# Altium schematic sheet [02] - nRF52.SchDoc: EE-02 - nRF52
size A4; DocumentNumber: 3; SheetNumber: 3; SheetTotal: 5
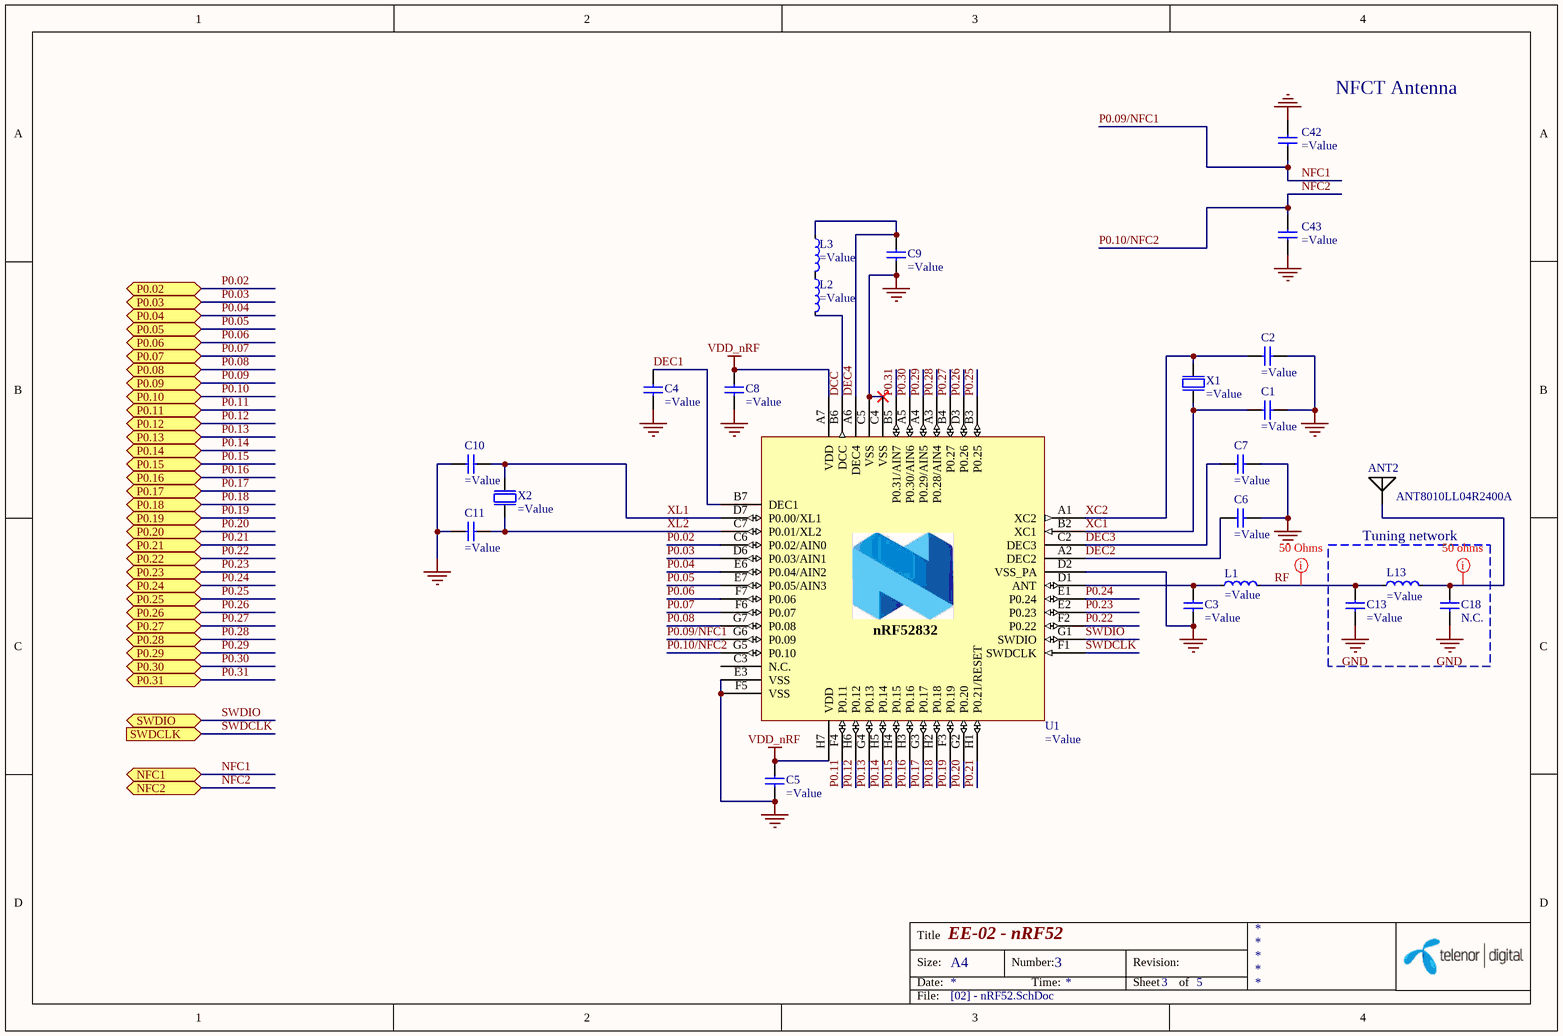
[diagram p0: [02] - nRF52.SchDoc]

## Parts
ANT2  ANT8010LL04R2400A  [YAGEO_24GHz]
C1  (no value)  [CAPC0603X03L]
C2  (no value)  [CAPC0603X03L]
C3  (no value)  [CAPC0603X03L]
C4  (no value)  [CAPC0603X03L]
C5  (no value)  [CAPC0603X03L]
C6  (no value)  [CAPC0603X03L]
C7  (no value)  [CAPC0603X03L]
C8  (no value)  [CAPC1608X06L]
C9  (no value)  [CAPC1005X04L]
C10  (no value)  [CAPC0603X03L]
C11  (no value)  [CAPC0603X03L]
C13  (no value)  [CAPC0603X03L]
C18  N.C.  [CAPC0603X03L]  (no BOM)
C42  (no value)  [CAPC0603X03L]
C43  (no value)  [CAPC0603X03L]
L1  (no value)  [INDC0603X03L]
L2  (no value)  [INDC1608X06L]
L3  (no value)  [INDC1005X04L]
L13  (no value)  [INDC0603X03L]
U1  (no value)  [BGA50C40P7X8_295X322X50]
X1  (no value)  [XTAL_ECS_2016]
X2  (no value)  [XTAL_1610]

## Blocks framed on the sheet
Tuning network: C13 C18 L13

## Ports
NFC1 (bidir), NFC2 (bidir), P0.02 (bidir), P0.03 (bidir), P0.04 (bidir), P0.05 (bidir), P0.06 (bidir), P0.07 (bidir), P0.08 (bidir), P0.09 (bidir), P0.10 (bidir), P0.11 (bidir), P0.12 (bidir), P0.13 (bidir), P0.14 (bidir), P0.15 (bidir), P0.16 (bidir), P0.17 (bidir), P0.18 (bidir), P0.19 (bidir), P0.20 (bidir), P0.21 (bidir), P0.22 (bidir), P0.23 (bidir), P0.24 (bidir), P0.25 (bidir), P0.26 (bidir), P0.27 (bidir), P0.28 (bidir), P0.29 (bidir), P0.30 (bidir), P0.31 (bidir), SWDCLK (in), SWDIO (bidir)

## Nets
GND: C1.2 C2.2 C3.1 C4.2 C5.2 C6.2 C7.2 C8.2 C9.1 C10.2 C11.2 C13.1 C18.1 C42.2 C43.1 U1.C4(VSS) U1.C5(VSS) U1.D2(VSS_PA) U1.E3(VSS) U1.F5(VSS) X1.2 X1.4
VDD_nRF: C5.1 C8.1 U1.A7(VDD) U1.H7(VDD)
DCC: L2.2 U1.B6(DCC)
DEC1: C4.1 U1.B7(DEC1)
DEC2: C6.1 U1.A2(DEC2)
DEC3: C7.1 U1.C2(DEC3)
DEC4: C9.2 L3.1 U1.A6(DEC4)
NFC1: C42.1 U1.G6(P0.09) ; port NFC1  [also labelled P0.09/NFC1]
NFC2: C43.2 U1.G5(P0.10) ; port NFC2  [also labelled P0.10/NFC2]
P0.02: U1.C6(P0.02/AIN0) ; port P0.02
P0.03: U1.D6(P0.03/AIN1) ; port P0.03
P0.04: U1.E6(P0.04/AIN2) ; port P0.04
P0.05: U1.E7(P0.05/AIN3) ; port P0.05
P0.06: U1.F7(P0.06) ; port P0.06
P0.07: U1.F6(P0.07) ; port P0.07
P0.08: U1.G7(P0.08) ; port P0.08
P0.09: port P0.09
P0.10: port P0.10
P0.11: U1.F4(P0.11) ; port P0.11
P0.12: U1.H6(P0.12) ; port P0.12
P0.13: U1.G4(P0.13) ; port P0.13
P0.14: U1.H5(P0.14) ; port P0.14
P0.15: U1.H4(P0.15) ; port P0.15
P0.16: U1.H3(P0.16) ; port P0.16
P0.17: U1.G3(P0.17) ; port P0.17
P0.18: U1.H2(P0.18) ; port P0.18
P0.19: U1.F3(P0.19) ; port P0.19
P0.20: U1.G2(P0.20) ; port P0.20
P0.21: U1.H1(P0.21/RESET) ; port P0.21
P0.22: U1.F2(P0.22) ; port P0.22
P0.23: U1.E2(P0.23) ; port P0.23
P0.24: U1.E1(P0.24) ; port P0.24
P0.25: U1.B3(P0.25) ; port P0.25
P0.26: U1.D3(P0.26) ; port P0.26
P0.27: U1.B4(P0.27) ; port P0.27
P0.28: U1.A3(P0.28/AIN4) ; port P0.28
P0.29: U1.A4(P0.29/AIN5) ; port P0.29
P0.30: U1.A5(P0.30/AIN6) ; port P0.30
P0.31: U1.B5(P0.31/AIN7) ; port P0.31
RF: C13.2 L1.2 L13.1
SWDCLK: U1.F1(SWDCLK) ; port SWDCLK
SWDIO: U1.G1(SWDIO) ; port SWDIO
XC1: C1.1 U1.B2(XC1) X1.1(inp)
XC2: C2.1 U1.A1(XC2) X1.3(out)
XL1: C10.1 U1.D7(P0.00/XL1) X2.1(inp)
XL2: C11.1 U1.C7(P0.01/XL2) X2.2(out)
NetANT2_1: ANT2.1(Feed) C18.2 L13.2
NetC3_2: C3.2 L1.1 U1.D1(ANT)
NetL2_1: L2.1 L3.2

Not connected (* = marked no-connect by the designer): U1 C3(N.C.)

## Layout directives
net class 50 Ohm Impedance: RF
net class 50 ohms impedance: NetANT2_1

## Notes on the sheet
- NFCT Antenna
- Title
- Size:
- Date:
- A4
- Number:
- Time:
- Revision:
- Sheet
- of
- File:
- (in symbol NRF52832-CIAA-R) nRF52832

## Library data of the parts
ANT2 = ANT8010LL04R2400A: CHIP ANTENNA 2.4GHZ; Manufacturer: Yageo; Frequency Group: UHF (2 GHz ~ 3 GHz); Frequency Range: 2.4GHz ~ 2.5GHz; Number of Bands: 1; Gain: 5.46dBi; Power - Max: 1W; Supplier 1: Digi-Key; Manufacturer Part Number: ANT8010LL04R2400A; RoHS: RoHS Compliant; Category: RF/IF and RFID; Stock 1: 771; Pricing 1: 1=1.4, 10=1.241, 25=1.1204, 100=0.9803, 250=0.85972, 500=0.76248, 750=0.66521, 1000=0.60297 (EUR); Packaging: *; Frequency (Center/Band): 2.4GHz; Antenna Type: Chip; VSWR: -; Return Loss: -; Features: -; Termination: Solder; Ingress Protection: -; Mounting Type: Surface Mount; Height (Max): 0.039" (1.00mm); Applications: Bluetooth, WLAN, Zigbee™; ComponentLink1URL: http://www.yageo.com/documents/recent/An_SMD_Bt_11bg_2450_8010_0.pdf; ComponentLink1Description: http://www.yageo.com/documents/recent/An_SMD_Bt_11bg_2450_8010_0.pdf; Supplier Part Number 1: 311-1550-6-ND
C1 C2 C10 C11 = GRM0335C1H120GA01D: CAP CER 12PF 50V NP0 0201; Manufacturer: Murata Electronics North America; Tolerance: ±2%; Temperature Coefficient: C0G, NP0; Manufacturer Part Number: GRM0335C1H120GA01D; Value: 12pF; Supplier 1: Digi-Key; RoHS: RoHS Compliant; Category: Capacitors; Stock 1: 92426; Pricing 1: 1=0.1, 10=0.014, 50=0.0078, 100=0.0066, 250=0.0054, 500=0.00462, 1000=0.0036, 5000=0.003 (USD); Packaging: Digi-Reel®; Capacitance: 12pF; Voltage - Rated: 50V; Mounting Type: Surface Mount, MLCC; Operating Temperature: -55°C ~ 125°C; Applications: General Purpose; Ratings: -; Package / Case: 0201 (0603 Metric); Size / Dimension: 0.024" L x 0.012" W (0.60mm x 0.30mm); Height - Seated (Max): -; Thickness (Max): 0.013" (0.33mm); Lead Spacing: -; Features: -; Lead Style: -; ComponentLink1URL: http://www.murata.com/~/media/webrenewal/support/library/catalog/products/capacitor/mlcc/c02e.pdf; ComponentLink1Description: http://www.murata.com/~/media/webrenewal/support/library/catalog/products/capacitor/mlcc/c02e.pdf; Supplier Part Number 1: 490-11308-6-ND; Part Status: Active; Failure Rate: *
C3 = GRM0335C1H1R0BA01D: CAP CER 1PF 50V NP0 0201; Manufacturer: Murata Electronics North America; Tolerance: ±0.1pF; Temperature Coefficient: C0G, NP0; Manufacturer Part Number: GRM0335C1H1R0BA01D; Value: 1pF; Supplier 1: Digi-Key; RoHS: RoHS Compliant; Category: Capacitors; Stock 1: 205704; Pricing 1: 1=0.1, 10=0.014, 50=0.0078, 100=0.0066, 250=0.0054, 500=0.00462, 1000=0.0036, 5000=0.003 (USD); Packaging: Digi-Reel®; Capacitance: 1pF; Voltage - Rated: 50V; Mounting Type: Surface Mount, MLCC; Operating Temperature: -55°C ~ 125°C; Applications: General Purpose; Ratings: -; Package / Case: 0201 (0603 Metric); Size / Dimension: 0.024" L x 0.012" W (0.60mm x 0.30mm); Height - Seated (Max): -; Thickness (Max): 0.013" (0.33mm); Lead Spacing: -; Features: -; Lead Style: -; ComponentLink1URL: http://www.murata.com/~/media/webrenewal/support/library/catalog/products/capacitor/mlcc/c02e.pdf; ComponentLink1Description: http://www.murata.com/~/media/webrenewal/support/library/catalog/products/capacitor/mlcc/c02e.pdf; Supplier Part Number 1: 490-9660-6-ND; Part Status: Active; Failure Rate: *
C4 C5 = GRM033R61C104KE84D: CAP CER 0.1UF 16V X5R 0201; Manufacturer: Murata Electronics North America; Value: 0.10µF; Tolerance: ±10%; Manufacturer Part Number: GRM033R61C104KE84D; Supplier 1: Digi-Key; RoHS: RoHS Compliant; Category: Capacitors; Stock 1: 0; Pricing 1: 1=0.1, 10=0.025, 50=0.0136, 100=0.0116, 250=0.00944, 500=0.00808, 1000=0.0063, 5000=0.00525 (USD); Packaging: Digi-Reel®; Capacitance: 0.10µF; Voltage - Rated: 16V; Temperature Coefficient: X5R; Mounting Type: Surface Mount, MLCC; Operating Temperature: -55°C ~ 85°C; Applications: General Purpose; Ratings: -; Package / Case: 0201 (0603 Metric); Size / Dimension: 0.024" L x 0.012" W (0.60mm x 0.30mm); Height - Seated (Max): -; Thickness (Max): 0.013" (0.33mm); Lead Spacing: -; Features: Derating Recommended; Lead Style: -; ComponentLink1URL: http://www.murata.com/~/media/webrenewal/support/library/catalog/products/capacitor/mlcc/c02e.pdf; ComponentLink1Description: http://www.murata.com/~/media/webrenewal/support/library/catalog/products/capacitor/mlcc/c02e.pdf; Supplier Part Number 1: 490-9985-6-ND; Part Status: Active; Failure Rate: *
C6 C7 = GRM0335C1H101GA01D: CAP CER 100PF 50V NP0 0201; Manufacturer: Murata Electronics North America; Tolerance: ±2%; Temperature Coefficient: C0G, NP0; Manufacturer Part Number: GRM0335C1H101GA01D; Value: 100pF; Supplier 1: Digi-Key; RoHS: RoHS Compliant; Category: Capacitors; Stock 1: 457199; Pricing 1: 1=0.1, 10=0.014, 50=0.0078, 100=0.0066, 250=0.0054, 500=0.00462, 1000=0.0036, 5000=0.003 (USD); Packaging: Digi-Reel®; Capacitance: 100pF; Voltage - Rated: 50V; Mounting Type: Surface Mount, MLCC; Operating Temperature: -55°C ~ 125°C; Applications: General Purpose; Ratings: -; Package / Case: 0201 (0603 Metric); Size / Dimension: 0.024" L x 0.012" W (0.60mm x 0.30mm); Height - Seated (Max): -; Thickness (Max): 0.013" (0.33mm); Lead Spacing: -; Features: -; Lead Style: -; ComponentLink1URL: http://www.murata.com/~/media/webrenewal/support/library/catalog/products/capacitor/mlcc/c02e.pdf; ComponentLink1Description: http://www.murata.com/~/media/webrenewal/support/library/catalog/products/capacitor/mlcc/c02e.pdf; Supplier Part Number 1: 490-7751-6-ND; Part Status: Active; Failure Rate: *
C8 = GRM188R60J475KE19D: CAP CER 4.7UF 6.3V X5R 0603; Manufacturer: Murata Electronics North America; Value: 4.7µF; Tolerance: ±10%; Manufacturer Part Number: GRM188R60J475KE19D; Supplier 1: Digi-Key; RoHS: RoHS Compliant; Category: Capacitors; Stock 1: 652092; Pricing 1: 1=0.12, 10=0.08, 50=0.046, 100=0.038, 250=0.032, 500=0.0268, 1000=0.022 (USD); Packaging: Digi-Reel®; Capacitance: 4.7µF; Voltage - Rated: 6.3V; Temperature Coefficient: X5R; Mounting Type: Surface Mount, MLCC; Operating Temperature: -55°C ~ 85°C; Applications: General Purpose; Ratings: -; Package / Case: 0603 (1608 Metric); Size / Dimension: 0.063" L x 0.031" W (1.60mm x 0.80mm); Height - Seated (Max): -; Thickness (Max): 0.035" (0.90mm); Lead Spacing: -; Features: -; Lead Style: -; ComponentLink1URL: http://www.murata.com/~/media/webrenewal/support/library/catalog/products/capacitor/mlcc/c02e.pdf; ComponentLink1Description: http://www.murata.com/~/media/webrenewal/support/library/catalog/products/capacitor/mlcc/c02e.pdf; Supplier Part Number 1: 490-3297-6-ND
C9 = GRM155R70J105KA12D: CAP CER 1UF 6.3V X7R 0402; Manufacturer: Murata Electronics North America; Value: 1µF; Tolerance: ±10%; Manufacturer Part Number: GRM155R70J105KA12D; Supplier 1: Digi-Key; RoHS: RoHS Compliant; Category: Capacitors; Stock 1: 3321; Pricing 1: 1=0.1, 10=0.072, 50=0.039, 100=0.033, 250=0.027, 500=0.0231, 1000=0.018, 5000=0.015 (USD); Packaging: Digi-Reel®; Capacitance: 1µF; Voltage - Rated: 6.3V; Temperature Coefficient: X7R; Mounting Type: Surface Mount, MLCC; Operating Temperature: -55°C ~ 125°C; Applications: General Purpose; Ratings: -; Package / Case: 0402 (1005 Metric); Size / Dimension: 0.039" L x 0.020" W (1.00mm x 0.50mm); Height - Seated (Max): -; Thickness (Max): 0.022" (0.55mm); Lead Spacing: -; Features: Derating Recommended; Lead Style: -; ComponentLink1URL: http://www.murata.com/~/media/webrenewal/support/library/catalog/products/capacitor/mlcc/c02e.pdf; ComponentLink1Description: http://www.murata.com/~/media/webrenewal/support/library/catalog/products/capacitor/mlcc/c02e.pdf; Supplier Part Number 1: 490-10024-6-ND; Part Status: Active; Failure Rate: *
C13 = 250R05L3R0BV4T: CAP CER 3PF 25V NP0 0201; Manufacturer: Johanson Technology Inc.; Tolerance: ±0.1pF; Temperature Coefficient: C0G, NP0; Manufacturer Part Number: 250R05L3R0BV4T; Value: 3pF; Supplier 1: Digi-Key; RoHS: RoHS Compliant; Category: Capacitors; Stock 1: 107635; Pricing 1: 1=0.23, 10=0.16, 25=0.1172, 50=0.0958, 100=0.0809, 250=0.06596, 500=0.05532, 1000=0.04894, 5000=0.04256 (USD); Packaging: Digi-Reel®; Part Status: Active; Capacitance: 3pF; Voltage - Rated: 25V; Operating Temperature: -55°C ~ 125°C; Features: High Q, Low Loss; Ratings: -; Applications: RF, Microwave, High Frequency; Mounting Type: Surface Mount, MLCC; Package / Case: 0201 (0603 Metric); Size / Dimension: 0.024" L x 0.012" W (0.60mm x 0.30mm); Height - Seated (Max): -; Thickness (Max): 0.013" (0.33mm); Lead Spacing: -; Lead Style: -; ComponentLink1URL: http://www.johansontechnology.com/downloads/JTI-CAT-MLCC-HighQ.pdf; ComponentLink1Description: http://www.johansontechnology.com/downloads/JTI-CAT-MLCC-HighQ.pdf; Supplier Part Number 1: 712-1191-6-ND
C18 = CAP_0201-NC: Capacitor, 0201, N.C.; Part Number: C0201-NC; Artikkelnr Noca: N.A.; Manufacturer: *; Manufacturer Part Number: *; Datasheet: *; LatestRevisionDate: 2016-11-04; Pin Count: 2; Publisher: Telenor Digital; Published: 2016-11-04; Value: N.C.; Note: *; Supplier: *; Supplier part number: *; 2nd source Supplier: *; 2nd source part number: *; Footprint Doc: 0201; Artikkelnr Simpro: N.A.
C42 C43 = GRM033R71C331KA01D: CAP CER 330PF 16V X7R 0201; Manufacturer: Murata Electronics North America; Tolerance: ±10%; Manufacturer Part Number: GRM033R71C331KA01D; Value: 330pF; Supplier 1: Digi-Key; RoHS: RoHS Compliant; Category: Capacitors; Stock 1: 85950; Pricing 1: 1=0.1, 10=0.018, 50=0.0098, 100=0.0083, 250=0.00676, 500=0.00578, 1000=0.0045, 5000=0.00375 (USD); Capacitance: 330pF; Packaging: Digi-Reel®; ComponentLink1URL: http://www.murata.com/~/media/webrenewal/support/library/catalog/products/capacitor/mlcc/c02e.pdf; ComponentLink1Description: http://www.murata.com/~/media/webrenewal/support/library/catalog/products/capacitor/mlcc/c02e.pdf; Supplier Part Number 1: 490-11359-6-ND; Voltage - Rated: 16V; Temperature Coefficient: X7R; Mounting Type: Surface Mount, MLCC; Operating Temperature: -55°C ~ 125°C; Applications: General Purpose; Ratings: -; Package / Case: 0201 (0603 Metric); Size / Dimension: 0.024" L x 0.012" W (0.60mm x 0.30mm); Height - Seated (Max): -; Thickness (Max): 0.013" (0.33mm); Lead Spacing: -; Features: -; Lead Style: -; Part Status: Active; Failure Rate: *
L1 = LQP03TN3N3B02D: FIXED IND 3.3NH 450MA 250 MOHM; Manufacturer: Murata Electronics North America; Type: Thin Film; Material - Core: Non-Magnetic; Tolerance: ±0.1nH; Shielding: Unshielded; DC Resistance (DCR): 250 mOhm Max; Q @ Freq: 14 @ 500MHz; Frequency - Self Resonant: 8GHz; Frequency - Test: 500MHz; Manufacturer Part Number: LQP03TN3N3B02D; Value: 3.3nH; Supplier 1: Digi-Key; RoHS: RoHS Compliant; Category: Inductors, Coils, Chokes; Stock 1: 28077; Pricing 1: 1=0.1, 10=0.05, 25=0.0452, 50=0.0406, 100=0.0351, 250=0.03152, 500=0.02926, 750=0.027, 1000=0.02565 (USD); Packaging: Digi-Reel®; Inductance: 3.3nH; Current Rating: 450mA; Current - Saturation: -; Ratings: -; Operating Temperature: -55°C ~ 125°C; Mounting Type: Surface Mount; Package / Case: 0201 (0603 Metric); Size / Dimension: 0.024" L x 0.012" W (0.60mm x 0.30mm); Height - Seated (Max): 0.013" (0.33mm); ComponentLink1URL: http://search.murata.co.jp/Ceramy/image/img/P02/JELF243C-0015.pdf; ComponentLink1Description: http://search.murata.co.jp/Ceramy/image/img/P02/JELF243C-0015.pdf; Supplier Part Number 1: 490-12988-6-ND; Part Status: Active
L2 = LBMF1608T100K: FIXED IND 10UH 80MA 360 MOHM SMD; Manufacturer: Taiyo Yuden; Value: 10µH; Type: Wirewound; Tolerance: ±10%; Shielding: Unshielded; Frequency - Self Resonant: 32MHz; Frequency - Test: 2.52MHz; Manufacturer Part Number: LBMF1608T100K; Supplier 1: Digi-Key; RoHS: RoHS Compliant; Category: Inductors, Coils, Chokes; Stock 1: 39014; Pricing 1: 1=0.25, 10=0.225, 25=0.2024, 50=0.1756, 100=0.1575, 250=0.14624, 500=0.135, 1000=0.117 (USD); Packaging: Digi-Reel®; Material - Core: -; Inductance: 10µH; Current Rating: 80mA; Current - Saturation: -; DC Resistance (DCR): 360 mOhm; Q @ Freq: -; Ratings: -; Operating Temperature: -40°C ~ 105°C; Mounting Type: Surface Mount; Package / Case: 0603 (1608 Metric); Size / Dimension: 0.063" L x 0.031" W (1.60mm x 0.80mm); Height - Seated (Max): 0.039" (1.00mm); ComponentLink1URL: http://ds.yuden.co.jp/TYCOMPAS/ut/detail.do?productNo=LBMF1608T100K&fileName=LBMF1608T100K_SS&mode=specSheetDownload; ComponentLink1Description: http://ds.yuden.co.jp/TYCOMPAS/ut/detail.do?productNo=LBMF1608T100K&fileName=LBMF1608T100K_SS&mode=specSheetDownload; Supplier Part Number 1: 587-1714-6-ND
L3 = HK100515NJ-T: FIXED IND 15NH 320MA 460 MOHM; Manufacturer: Taiyo Yuden; Type: Multilayer; Material - Core: Ferrite; Tolerance: ±5%; Shielding: Unshielded; DC Resistance (DCR): 460 mOhm Max; Q @ Freq: 8 @ 100MHz; Frequency - Self Resonant: 2.3GHz; Frequency - Test: 100MHz; Manufacturer Part Number: HK100515NJ-T; Value: 15nH; Supplier 1: Digi-Key; RoHS: RoHS Compliant; Category: Inductors, Coils, Chokes; Stock 1: 163730; Pricing 1: 1=0.1, 10=0.06, 25=0.054, 50=0.0468, 100=0.042, 250=0.039, 500=0.036, 1000=0.0312 (USD); Packaging: Digi-Reel®; Inductance: 15nH; Current Rating: 320mA; Current - Saturation: -; Ratings: -; Operating Temperature: -55°C ~ 125°C; Mounting Type: Surface Mount; Package / Case: 0402 (1005 Metric); Size / Dimension: 0.039" L x 0.020" W (1.00mm x 0.50mm); Height - Seated (Max): 0.022" (0.55mm); ComponentLink1URL: http://ds.yuden.co.jp/TYCOMPAS/ut/detail.do?productNo=HK100515NJ-T&fileName=HK100515NJ-T_SS&mode=specSheetDownload; ComponentLink1Description: http://ds.yuden.co.jp/TYCOMPAS/ut/detail.do?productNo=HK100515NJ-T&fileName=HK100515NJ-T_SS&mode=specSheetDownload; Supplier Part Number 1: 587-1521-6-ND
L13 = LQP03TN3N3B02D: FIXED IND 3.3NH 450MA 250 MOHM; Manufacturer: Murata Electronics North America; Tolerance: ±0.1nH; Type: Thin Film; Material - Core: Non-Magnetic; Shielding: Unshielded; DC Resistance (DCR): 250 mOhm Max; Q @ Freq: 14 @ 500MHz; Frequency - Self Resonant: 8GHz; Frequency - Test: 500MHz; Supplier 1: Digi-Key; Manufacturer Part Number: LQP03TN3N3B02D; RoHS: RoHS Compliant; Category: Inductors, Coils, Chokes; Stock 1: 28077; Pricing 1: 1=0.1, 10=0.05, 25=0.0452, 50=0.0406, 100=0.0351, 250=0.03152, 500=0.02926, 750=0.027, 1000=0.02565 (USD); Packaging: Digi-Reel®; Operating Temperature: -55°C ~ 125°C; Package / Case: 0201 (0603 Metric); Size / Dimension: 0.024" L x 0.012" W (0.60mm x 0.30mm); ComponentLink1URL: http://search.murata.co.jp/Ceramy/image/img/P02/JELF243C-0015.pdf; ComponentLink1Description: http://search.murata.co.jp/Ceramy/image/img/P02/JELF243C-0015.pdf; Supplier Part Number 1: 490-12988-6-ND; Value: 3.3nH; Part Status: Active; Height - Seated (Max): 0.013" (0.33mm); Inductance: 3.3nH; Current Rating: 450mA; Current - Saturation: -; Ratings: -; Mounting Type: Surface Mount
U1 = NRF52832-CIAA-R: nRF52832-CIAA - IC RF TXRX+MCU BLUETOOTH 50WLCSP; Manufacturer: Nordic Semiconductor ASA; Manufacturer Part Number: NRF52832-CIAA-R; Supplier 1: Digi-Key; RoHS: RoHS Compliant; Category: RF/IF and RFID; Stock 1: 0; Pricing 1: 1=5.91, 10=5.276, 25=4.7488, 100=4.3265, 250=3.90444, 500=3.50344, 1000=2.9547 (USD); Packaging: Digi-Reel®; Part Status: Active; Type: TxRx + MCU; RF Family/Standard: *; Protocol: *; Modulation: *; Frequency: *; Data Rate (Max): *; Power - Output: *; Sensitivity: *; Memory Size: *; Serial Interfaces: *; GPIO: *; Voltage - Supply: *; Current - Receiving: *; Current - Transmitting: *; Operating Temperature: *; Package / Case: *; ComponentLink1URL: http://infocenter.nordicsemi.com/pdf/nRF52832_PB_v1.4.pdf; ComponentLink1Description: http://infocenter.nordicsemi.com/pdf/nRF52832_PB_v1.4.pdf; Supplier Part Number 1: 1490-1056-6-ND; Value: NRF52832-CIAA-R
X1 = ECS-320-8-37CKM: CRYSTAL 32.0000MHZ 8PF SMD; Manufacturer: ECS Inc.; Value: 32MHz; Frequency Stability: ±10ppm; ESR (Equivalent Series Resistance): 60 Ohm; Operating Mode: Fundamental; Manufacturer Part Number: ECS-320-8-37CKM; Supplier 1: Digi-Key; RoHS: RoHS Compliant; Category: Crystals, Oscillators, Resonators; Stock 1: 8917; Pricing 1: 1=1.09, 10=0.968, 50=0.904, 100=0.8, 500=0.756 (USD); Packaging: Digi-Reel®; Type: MHz Crystal; Frequency: 32MHz; Frequency Tolerance: ±10ppm; Load Capacitance: 8pF; Operating Temperature: -20°C ~ 70°C; Ratings: -; Mounting Type: Surface Mount; Package / Case: 4-SMD, No Lead (DFN, LCC); Size / Dimension: 0.079" L x 0.063" W (2.00mm x 1.60mm); Height: 0.020" (0.50mm); ComponentLink1URL: http://www.ecsxtal.com/store/pdf/ecx-1637.pdf; ComponentLink1Description: http://www.ecsxtal.com/store/pdf/ecx-1637.pdf; Supplier Part Number 1: XC1547DKR-ND; Part Status: Active
X2 = 9HT12-32.768KBZC-T: CRYSTAL 32.7680KHZ 9PF SMD; Manufacturer: TXC CORPORATION; Value: 32.768kHz; Frequency Tolerance: ±50ppm; ESR (Equivalent Series Resistance): 90 kOhm; Operating Mode: Fundamental; Manufacturer Part Number: 9HT12-32.768KBZC-T; Supplier 1: Digi-Key; RoHS: RoHS Compliant; Category: Crystals, Oscillators, Resonators; Stock 1: 4978; Pricing 1: 1=1.14, 10=1.088, 50=1.0626, 100=0.9108, 500=0.8855, 1000=0.74635, 2500=0.7084 (USD); Packaging: Digi-Reel®; Type: kHz Crystal (Tuning Fork); Frequency: 32.768kHz; Frequency Stability: -; Load Capacitance: 9pF; Operating Temperature: -40°C ~ 85°C; Ratings: -; Mounting Type: Surface Mount; Package / Case: 2-SMD, No Lead (DFN, LCC); Size / Dimension: 0.063" L x 0.039" W (1.60mm x 1.00mm); Height: 0.020" (0.50mm); ComponentLink1URL: http://www.txccrystal.com/images/pdf/9ht12.pdf; ComponentLink1Description: http://www.txccrystal.com/images/pdf/9ht12.pdf; Supplier Part Number 1: 887-2621-6-ND; Part Status: Active